# Altium schematic sheet ,julj,.SchDoc
size A4; SheetNumber: 1; SheetTotal: 2
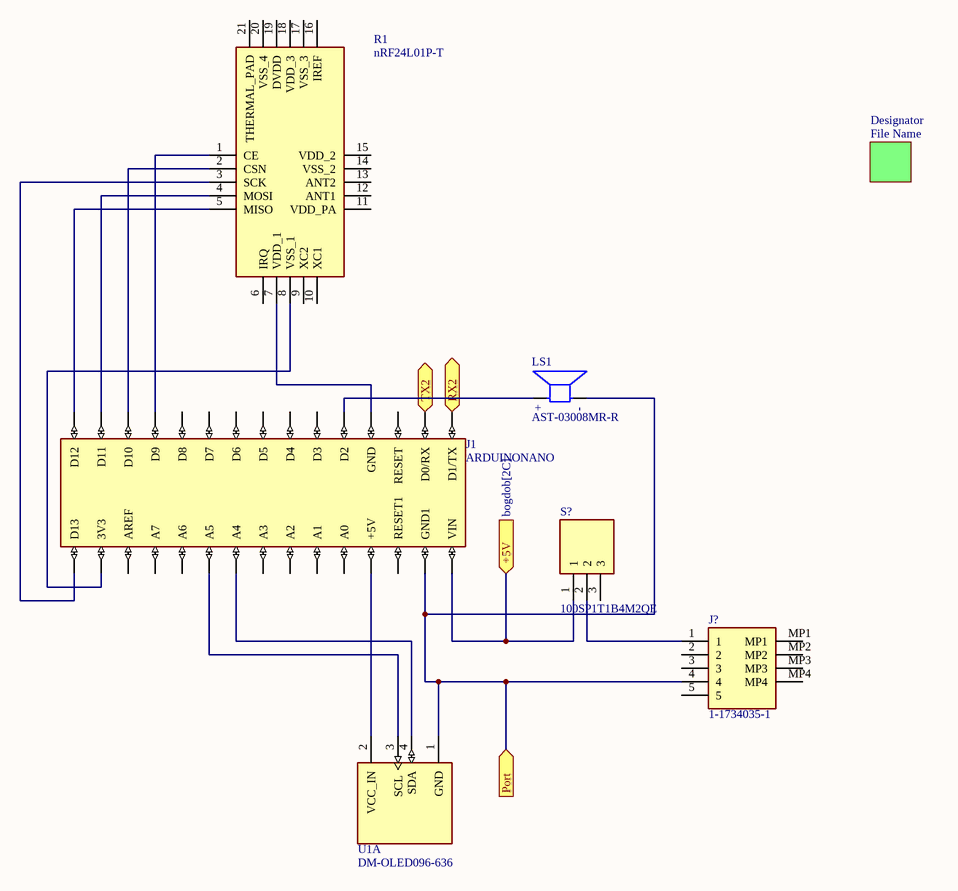
[diagram p0: ,julj,.SchDoc]

## Parts
J1  ARDUINONANO  [PDIP-32]
J?  1-1734035-1  [117340351]
LS1  AST-03008MR-R  [SPKR_AST-03008MR-R]
R1  nRF24L01P-T  [QFN50P400X400X95-21N-D]
S?  100SP1T1B4M2QE  [100SP1T1B4M2QE]
U1  DM-OLED096-636  [MODULE_DM-OLED096-636]  (part A of 6)

## Sub-sheets
Designator = File Name: no entries

## Ports
+5V (in, see bogdob[2C]), Port (in), RX2 (bidir), TX2 (bidir)

## Nets
+5V: J1.VIN S?.1 ; port +5V
Port: J1.GND1 J?.4 LS1.N U1.1(GND) ; port Port
RX2: J1.D1/TX ; port RX2
TX2: J1.D0/RX ; port TX2
NetJ1_3V3: J1.3V3 R1.8(VSS_1)
NetJ1_+5V: J1.+5V U1.2(VCC_IN)
NetJ1_A4: J1.A4 U1.4(SDA)
NetJ1_A5: J1.A5 U1.3(SCL)
NetJ1_D2: J1.D2 LS1.P
NetJ1_D9: J1.D9 R1.1(CE)
NetJ1_D10: J1.D10 R1.2(CSN)
NetJ1_D11: J1.D11 R1.4(MOSI)
NetJ1_D12: J1.D12 R1.5(MISO)
NetJ1_D13: J1.D13 R1.3(SCK)
NetJ1_GND: J1.GND R1.7(VDD_1)
NetJ?_1: J?.1 S?.2

Not connected (* = marked no-connect by the designer): J1 A0 A1 A2 A3 A6 A7 AREF D3 D4 D5 D6 D7 D8 RESET RESET1; J? 2 3 5 MP1 MP2 MP3 MP4; R1 6(IRQ) 9(XC2) 10(XC1) 11(VDD_PA) 12(ANT1) 13(ANT2) 14(VSS_2) 15(VDD_2) 16(IREF) 17(VSS_3) 18(VDD_3) 19(DVDD) 20(VSS_4) 21(THERMAL_PAD); S? 3

## Notes on the sheet
- (in symbol AST-03008MR-R) +; -

## Library data of the parts
J1 = ARDUINONANO: NINA-W102, RP2040 Arduino Nano RP2040 Connect with Headers series ARMÂ® CortexÂ®-M0+ MCU 32-Bit Embedded Evaluation Board; Value: *; SnapEDA_Link: https://www.snapeda.com/parts/ARDUINONANO/Arduino/view-part/?ref=snap; MF: Arduino; Availability: Not in stock; Price: None; Package: Non-Standard Arduino; Check_prices: https://www.snapeda.com/parts/ARDUINONANO/Arduino/view-part/?ref=eda; MP: ARDUINONANO
J? = 1-1734035-1: Connector; Manufacturer_Name: TE Connectivity; Datasheet Link: https://www.te.com/commerce/DocumentDelivery/DDEController?Action=showdoc&DocId=Customer+Drawing%7F1734035%7FF%7Fpdf%7FEnglish%7FENG_CD_1734035_F.pdf%7F1-1734035-1; Height: 4.14mm; Manufacturer_Part_Number: 1-1734035-1; Mouser Part Number: 571-1-1734035-1; Mouser Price/Stock: https://www.mouser.co.uk/ProductDetail/TE-Connectivity/1-1734035-1?qs=x6EjVpvqMVOdSE4jVN5kww%3D%3D; Arrow Part Number: 1-1734035-1; Arrow Price/Stock: https://www.arrow.com/en/products/1-1734035-1/te-connectivity?region=nac
LS1 = AST-03008MR-R: SPEAKER .15W 8OHM 72DB 1400HZ; MF: PUI Audio; SnapEDA_Link: https://www.snapeda.com/parts/AST-03008MR-R/PUI+Audio%252C+Inc./view-part/?ref=snap; Package: None; Value: *; MP: AST-03008MR-R; Check_prices: https://www.snapeda.com/parts/AST-03008MR-R/PUI+Audio%252C+Inc./view-part/?ref=eda
R1 = nRF24L01P-T: Integrated Circuit; Manufacturer_Name: Nordic Semiconductor; Datasheet Link: https://datasheet.datasheetarchive.com/originals/distributors/Datasheets-DGA19/4322.pdf; Height: 0.95mm; Manufacturer_Part_Number: nRF24L01P-T; Mouser Part Number: 949-NRF24L01P-T; Mouser Price/Stock: https://www.mouser.co.uk/ProductDetail/Nordic-Semiconductor/nRF24L01P-T?qs=yd0qOhnSiDf9ybbDsku6vg%3D%3D; Arrow Part Number: NRF24L01P-T; Arrow Price/Stock: null?region=nac
S? = 100SP1T1B4M2QE: Switch; Manufacturer_Name: E-Switch; Datasheet Link: https://configured-product-images.s3.amazonaws.com/2D/specs/100SP1T1B4M2QE.pdf; Height: 28mm; Manufacturer_Part_Number: 100SP1T1B4M2QE; Mouser Part Number: 612-100-A1421; Mouser Price/Stock: https://www.mouser.co.uk/ProductDetail/E-Switch/100SP1T1B4M2QE?qs=YXf4ACKMM4xJ0mJK%2FyIa1g%3D%3D
U1 = DM-OLED096-636: 0.96â€ 128 X 64 MONOCHROME GRAPHIC OLED DISPLAY MODULE - I2C; SnapEDA_Link: https://www.snapeda.com/parts/DM-OLED096-636/Display+Module/view-part/?ref=snap; Package: Package; Value: *; MF: Display Module; MP: DM-OLED096-636; Check_prices: https://www.snapeda.com/parts/DM-OLED096-636/Display+Module/view-part/?ref=eda